# EAGLE design gemschematic (EAGLE 9.6.2)
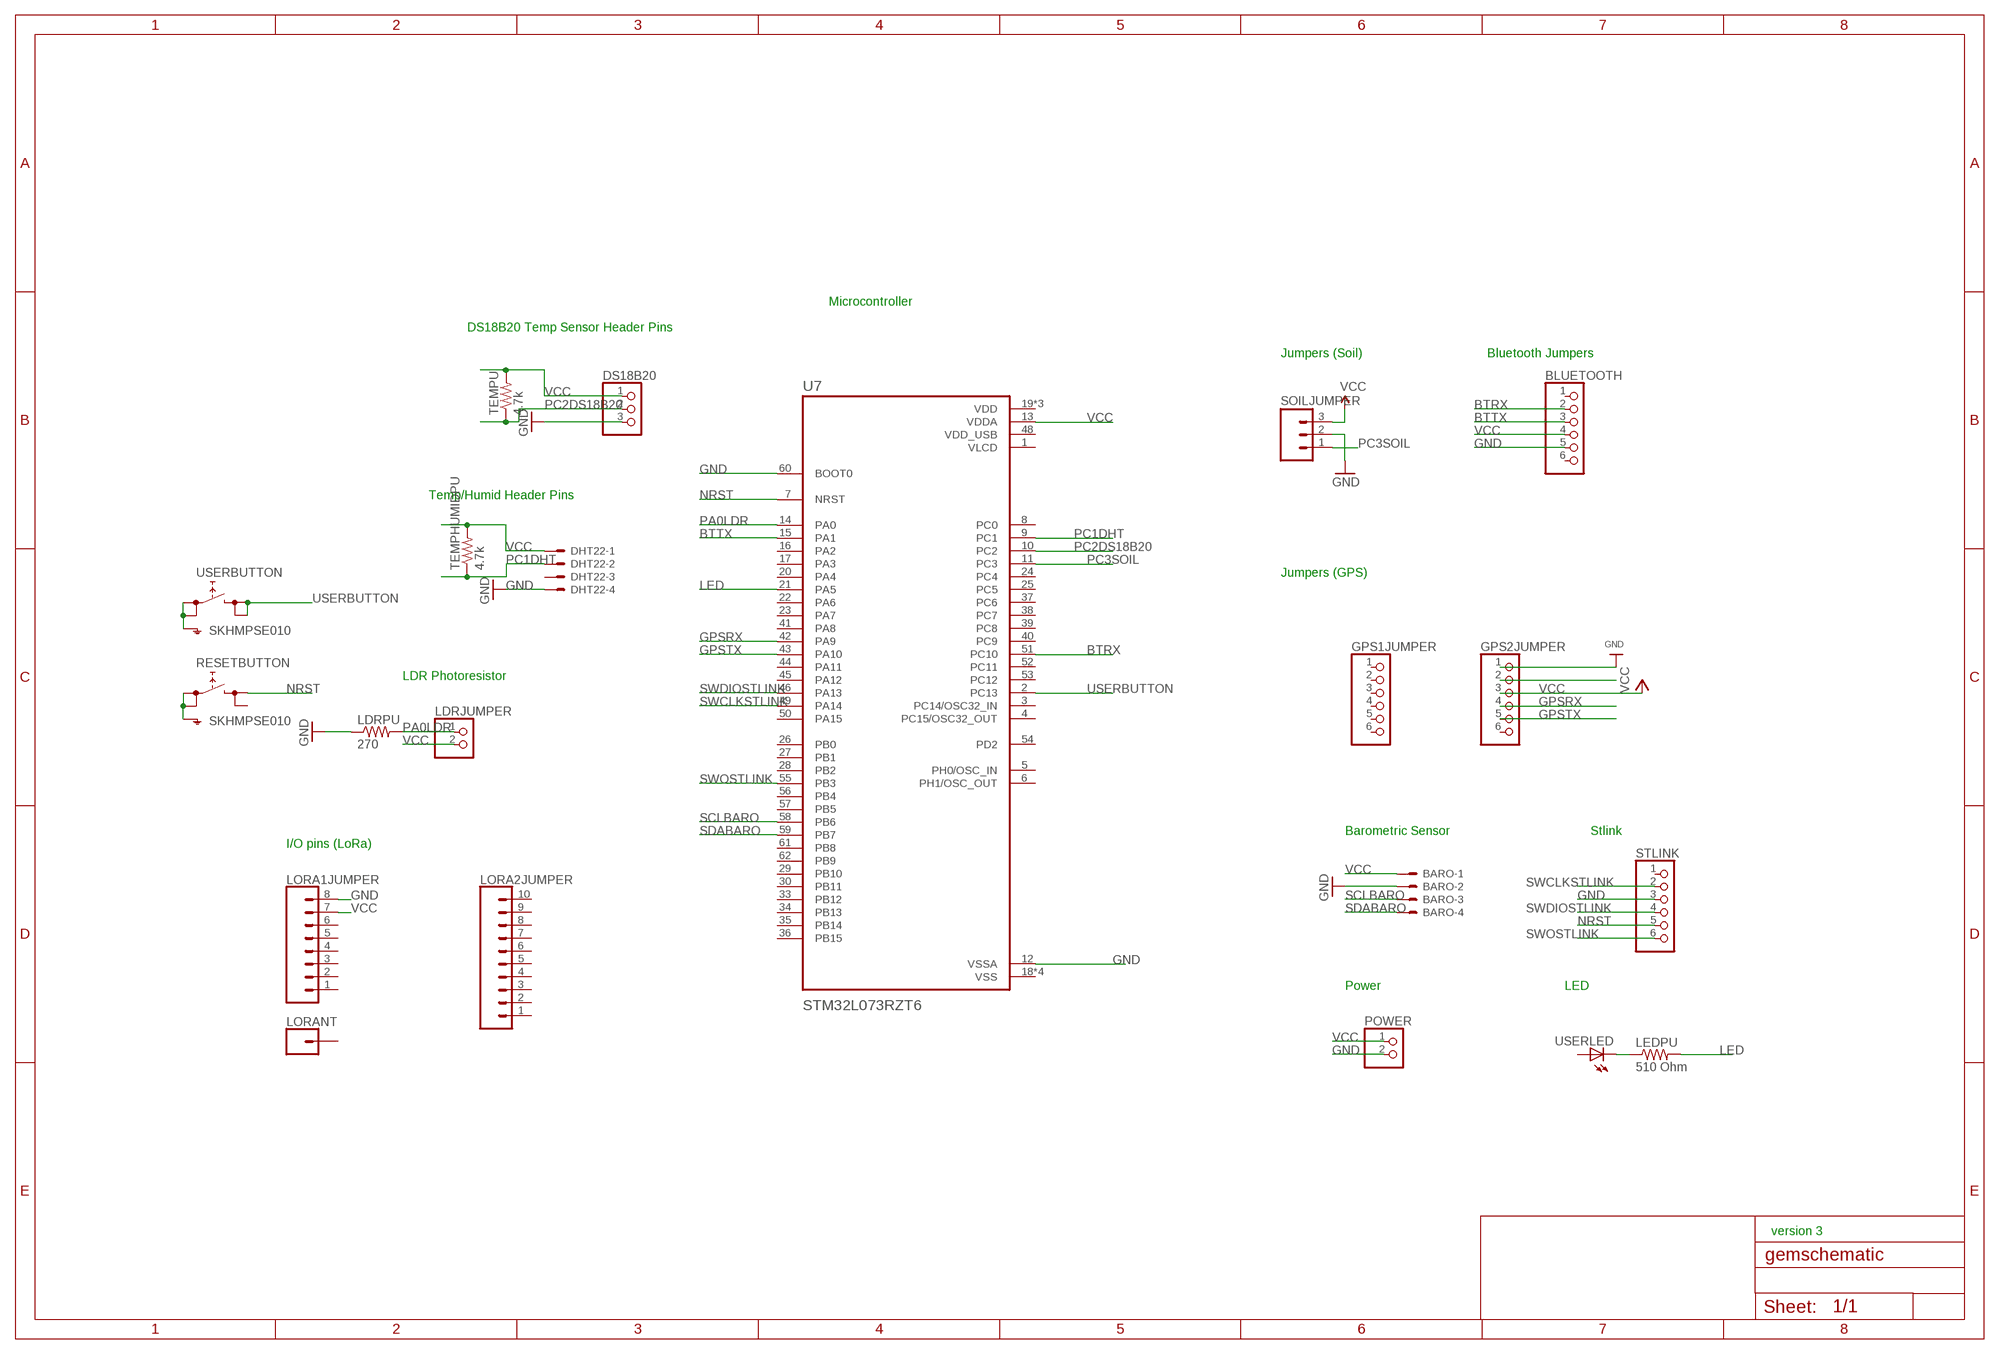
[diagram p0: schematic, sheet 1]

## Parts
BARO  22-23-2041  [22-23-2041]
BLUETOOTH  PINHD-1X6  [1X06]
DHT22  22-23-2041  [22-23-2041]
DS18B20  PINHD-1X3  [1X03]
GPS1JUMPER  HEADER-1X670MIL  [1X06_ROUND_70]
GPS2JUMPER  HEADER-1X670MIL  [1X06_ROUND_70]
LDRJUMPER  PINHD-1X2  [1X02]
LDRPU  270  R-US_M0805  [M0805]
LEDPU  510 Ohm  R-US_M0805  [M0805]
LORA1JUMPER  CONN_08NO_SILK_FEMALE_PTH  [1X08_NO_SILK]
LORA2JUMPER  CONN_10NO_SILK_PTH_FEMALE  [1X10_NO_SILK]
LORANT  CONN_01PTH_NO_SILK_YES_STOP  [1X01_NO_SILK]
POWER  PINHD-1X2  [1X02]
RESETBUTTON  SKHMPSE010  [SKHMPXE010]
SOILJUMPER  M03SCREW_LOCK  [SCREWTERMINAL-3.5MM-3_LOCK.007S]
STLINK  PINHD-1X6  [1X06]
TEMPHUMIDPU  4.7k  R-US_M0805  [M0805]
TEMPU  4.7k  R-US_M0805  [M0805]
U7  STM32L073RZT6  [QFP50P1200X1200X160-64N]
USERBUTTON  SKHMPSE010  [SKHMPXE010]
USERLED  LED3MM  [LED3MM]

## Nets
1PPS: GPS2JUMPER.2
BTRX: BLUETOOTH.2 U7.51(PC10)
BTTX: BLUETOOTH.3 U7.15(PA1)
GND: BARO.2 BLUETOOTH.5 DHT22.4 DS18B20.3 GPS2JUMPER.1 LDRPU.1 LORA1JUMPER.8 POWER.2 SOILJUMPER.2 STLINK.3 U7.12(VSSA) U7.60(BOOT0)
GPSRX: GPS2JUMPER.4 U7.42(PA9)
GPSTX: GPS2JUMPER.5 U7.43(PA10)
LED: LEDPU.2 U7.21(PA5)
N$1: LEDPU.1 USERLED.K(C)
N$2: USERBUTTON.1(1.1) USERBUTTON.2(1.2) USERBUTTON.5(SH)
N$4: RESETBUTTON.1(1.1) RESETBUTTON.2(1.2) RESETBUTTON.5(SH)
NRST: RESETBUTTON.3(2.1) STLINK.5 U7.7(NRST)
PA0LDR: LDRJUMPER.1 LDRPU.2 U7.14(PA0)
PC1DHT: DHT22.2 TEMPHUMIDPU.1 U7.9(PC1)
PC2DS18B20: DS18B20.2 TEMPU.1 U7.10(PC2)
PC3SOIL: SOILJUMPER.1 U7.11(PC3)
SCLBARO: BARO.3 U7.58(PB6)
SDABARO: BARO.4 U7.59(PB7)
SWCLKSTLINK: STLINK.2 U7.49(PA14)
SWDIOSTLINK: STLINK.4 U7.46(PA13)
SWOSTLINK: STLINK.6 U7.55(PB3)
USERBUTTON: U7.2(PC13) USERBUTTON.3(2.1) USERBUTTON.4(2.2)
VCC: BARO.1 BLUETOOTH.4 DHT22.1 DS18B20.1 GPS2JUMPER.3 LDRJUMPER.2 LORA1JUMPER.7 POWER.1 SOILJUMPER.3 TEMPHUMIDPU.2 TEMPU.2 U7.13(VDDA)
Unconnected: BLUETOOTH.1 BLUETOOTH.6 DHT22.3 GPS1JUMPER.1 GPS1JUMPER.2 GPS1JUMPER.3 GPS1JUMPER.4 GPS1JUMPER.5 GPS1JUMPER.6 GPS2JUMPER.6 LORA1JUMPER.1 LORA1JUMPER.2 LORA1JUMPER.3 LORA1JUMPER.4 LORA1JUMPER.5 LORA1JUMPER.6 LORA2JUMPER.1 LORA2JUMPER.2 LORA2JUMPER.3 LORA2JUMPER.4 LORA2JUMPER.5 LORA2JUMPER.6 LORA2JUMPER.7 LORA2JUMPER.8 LORA2JUMPER.9 LORA2JUMPER.10 LORANT.1 RESETBUTTON.4(2.2) STLINK.1 U7.3(PC14/OSC32_IN) U7.4(PC15/OSC32_OUT) U7.5(PH0/OSC_IN) U7.6(PH1/OSC_OUT) U7.8(PC0) U7.16(PA2) U7.17(PA3) U7.20(PA4) U7.22(PA6) U7.23(PA7) U7.24(PC4) U7.25(PC5) U7.26(PB0) U7.27(PB1) U7.28(PB2) U7.29(PB10) U7.30(PB11) U7.33(PB12) U7.34(PB13) U7.35(PB14) U7.36(PB15) U7.37(PC6) U7.38(PC7) U7.39(PC8) U7.40(PC9) U7.41(PA8) U7.44(PA11) U7.45(PA12) U7.50(PA15) U7.52(PC11) U7.53(PC12) U7.54(PD2) U7.56(PB4) U7.57(PB5) U7.61(PB8) U7.62(PB9) USERLED.A

## Notes on the sheet
- Microcontroller
- DS18B20 Temp Sensor Header Pins
- Jumpers (Soil) | Bluetooth Jumpers
- Temp/Humid Header Pins
- Jumpers (GPS)
- LDR Photoresistor
- Barometric Sensor | Stlink
- I/O pins (LoRa)
- Power | LED
- version 3

## Power pins joined to a net without a drawn wire
VDD: U7.19(VDD) U7.32(VDD) U7.64(VDD)
VDD_USB: U7.48(VDD_USB)
VLCD: U7.1(VLCD)
VSS: U7.18(VSS) U7.31(VSS) U7.47(VSS) U7.63(VSS)

## Library data of the parts
BARO DHT22 = con-molex:22-23-2041: .100" (2.54mm) Center Header - 4 Pin; MF: MOLEX; MPN: 22-23-2041; OC_FARNELL: 1462920; OC_NEWARK: 38C0355
BLUETOOTH STLINK = adafruit:PINHD-1X6: PIN HEADER
DS18B20 = adafruit:PINHD-1X3: PIN HEADER
GPS1JUMPER GPS2JUMPER = microbuilder:HEADER-1X6: PIN HEADER
LDRJUMPER POWER = pinhead:PINHD-1X2: PIN HEADER
LDRPU LEDPU TEMPHUMIDPU TEMPU = adafruit:R-US_: RESISTOR, American symbol
LORA1JUMPER = SparkFun-Connectors:CONN_08: Multi connection point. Often used as Generic Header-pin footprint for 0.1 inch spaced/style header connections On any of the 0.1 inch spaced packages, you can populate with these: Break Away Headers - Straight <https://www.sparkfun.com/products/116> (PRT-00116) Break Away Male Headers - Right Angle <https://www.sparkfun.com/products/553> (PRT-00553) Female Headers <https://www.sparkfun.com/products/115> (PRT-00115) Break Away Headers - Machine Pin <https://www.sparkfun.com/products/117> (PRT-00117) Break Away Female Headers - Swiss Machine Pin <https://www.sparkfun.com/products/743> (PRT-00743) Arduino Stackable Header - 8 Pin <https://www.sparkfun.com/products/9279> (PRT-09279) For SCREWTERMINALS and SPRING TERMINALS visit here: Screw Terimnals on SparkFun.com <https://www.sparkfun.com/search/results?term=Screw+Terminals> (5mm/3.5mm/2.54mm spacing) This device is also useful as a general connection point to wire up your design to another part of your project. Our various solder wires solder well into these plated through hole pads. Hook-Up Wire - Assortment (Stranded, 22 AWG) <https://www.sparkfun.com/products/11375> (PRT-11375) Hook-Up Wire - Assortment (Solid Core, 22 AWG) <https://www.sparkfun.com/products/11367> (PRT-11367) View the entire wire category on our website here <https://www.sparkfun.com/categories/141> Special notes: Molex polarized connector foot print use with SKU : PRT-08231 with associated crimp pins and housings. 1MM SMD Version SKU: PRT-10208 NOTES ON THE VARIANTS LOCK and LOCK_LONGPADS... This footprint was designed to help hold the alignment of a through-hole component (i.e. 6-pin header) while soldering it into place. You may notice that each hole has been shifted either up or down by 0.005 of an inch from it's more standard position (which is a perfectly straight line). This slight alteration caused the pins (the squares in the middle) to touch the edges of the holes. Because they are alternating, it causes a "brace" to hold the component in place. 0.005 has proven to be the perfect amount of "off-center" position when using our standard breakaway headers. Although looks a little odd when you look at the bare footprint, once you have a header in there, the alteration is very hard to notice. Also,if you push a header all the way into place, it is covered up entirely on the bottom side.; PROD_ID: CONN-08438
LORA2JUMPER = SparkFun-Connectors:CONN_10: Multi connection point. Often used as Generic Header-pin footprint for 0.1 inch spaced/style header connections On any of the 0.1 inch spaced packages, you can populate with these: Break Away Headers - Straight <https://www.sparkfun.com/products/116> (PRT-00116) Break Away Male Headers - Right Angle <https://www.sparkfun.com/products/553> (PRT-00553) Female Headers <https://www.sparkfun.com/products/115> (PRT-00115) Break Away Headers - Machine Pin <https://www.sparkfun.com/products/117> (PRT-00117) Break Away Female Headers - Swiss Machine Pin <https://www.sparkfun.com/products/743> (PRT-00743) Arduino Stackable Header - 10 Pin <https://www.sparkfun.com/products/11376> (PRT-11376) For SCREWTERMINALS and SPRING TERMINALS visit here: Screw Terimnals on SparkFun.com <https://www.sparkfun.com/search/results?term=Screw+Terminals> (5mm/3.5mm/2.54mm spacing) This device is also useful as a general connection point to wire up your design to another part of your project. Our various solder wires solder well into these plated through hole pads. Hook-Up Wire - Assortment (Stranded, 22 AWG) <https://www.sparkfun.com/products/11375> (PRT-11375) Hook-Up Wire - Assortment (Solid Core, 22 AWG) <https://www.sparkfun.com/products/11367> (PRT-11367) View the entire wire category on our website here <https://www.sparkfun.com/categories/141> Special notes: Molex polarized connector foot print use with SKU : PRT-08231 with associated crimp pins and housings. 1MM SMD Version SKU: PRT-10208 NOTES ON THE VARIANTS LOCK and LOCK_LONGPADS... This footprint was designed to help hold the alignment of a through-hole component (i.e. 6-pin header) while soldering it into place. You may notice that each hole has been shifted either up or down by 0.005 of an inch from it's more standard position (which is a perfectly straight line). This slight alteration caused the pins (the squares in the middle) to touch the edges of the holes. Because they are alternating, it causes a "brace" to hold the component in place. 0.005 has proven to be the perfect amount of "off-center" position when using our standard breakaway headers. Although looks a little odd when you look at the bare footprint, once you have a header in there, the alteration is very hard to notice. Also,if you push a header all the way into place, it is covered up entirely on the bottom side.; PROD_ID: CONN-11563
LORANT = SparkFun-Connectors:CONN_01: Single connection point. Often used as Generic Header-pin footprint for 0.1 inch spaced/style header connections On any of the 0.1 inch spaced packages, you can populate with these: Break Away Headers - Straight <https://www.sparkfun.com/products/116> (PRT-00116) Break Away Male Headers - Right Angle <https://www.sparkfun.com/products/553> (PRT-00553) Female Headers <https://www.sparkfun.com/products/115> (PRT-00115) Break Away Headers - Machine Pin <https://www.sparkfun.com/products/117> (PRT-00117) Break Away Female Headers - Swiss Machine Pin <https://www.sparkfun.com/products/743> (PRT-00743) This device is also useful as a general connection point to wire up your design to another part of your project. Our various solder wires solder well into these plated through hole pads. Hook-Up Wire - Assortment (Stranded, 22 AWG) <https://www.sparkfun.com/products/11375> (PRT-11375) Hook-Up Wire - Assortment (Solid Core, 22 AWG) <https://www.sparkfun.com/products/11367> (PRT-11367) View the entire wire category on our website here <https://www.sparkfun.com/categories/141> Special notes: SMTSO-256-ET is a "flush mount" nut for a 4-40 screw. We mostly use this on specialty testbeds; it is a nice way to connect hardware to your PCB at an adjustable hieght. Also note, the SNAP packages are for using a snappable style connector. We sell a baggie of snaps and they are also used on two LilyPad designs: Snap Assortment - 30 pack (male and female) <https://www.sparkfun.com/products/11347> (DEV-11347) LilyPad Arduino SimpleSnap <https://www.sparkfun.com/products/10941> (DEV-10941) LilyPad SimpleSnap Protoboard <https://www.sparkfun.com/products/10940> (DEV-10940)
RESETBUTTON USERBUTTON = switch:SKHMP*E010: 6.2 X 6.5mm TACT Switch (SMD) Source: http://www3.alps.co.jp/WebObjects/catalog.woa/PDF/E/Switch/Tact/SKHM/SKHM.PDF
SOILJUMPER = SparkFun-Connectors:M03: Header 3 Standard 3-pin 0.1" header. Use with straight break away headers (SKU : PRT-00116), right angle break away headers (PRT-00553), swiss pins (PRT-00743), machine pins (PRT-00117), and female headers (PRT-00115). Molex polarized connector foot print use with SKU : PRT-08232 with associated crimp pins and housings.; PROD_ID: CONN-08288
U7 = STM32L073RZT6:STM32L073RZT6: None Check availability <https://pricing.snapeda.com/parts/STM32L073RZT6/STMicroelectronics/view-part?ref=eda>; AVAILABILITY: In Stock; DESCRIPTION: ARM® Cortex®-M0+ STM32L0 Microcontroller IC 32-Bit 32MHz 192KB (192K x 8) FLASH 64-LQFP (10x10); MF: STMicroelectronics; MP: STM32L073RZT6; PACKAGE: LQFP-64 STMicroelectronics; PRICE: None; PURCHASE-URL: https://pricing.snapeda.com/search/part/STM32L073RZT6/?ref=eda
USERLED = adafruit:LED: LED OSRAM: - CHIPLED LG R971, LG N971, LY N971, LG Q971, LY Q971, LO R971, LY R971 LH N974, LH R974 LS Q976, LO Q976, LY Q976 LO Q996 - Hyper CHIPLED LW Q18S LB Q993, LB Q99A, LB R99A - SideLED LS A670, LO A670, LY A670, LG A670, LP A670 LB A673, LV A673, LT A673, LW A673 LH A674 LY A675 LS A676, LA A676, LO A676, LY A676, LW A676 LS A679, LY A679, LG A679 - Hyper Micro SIDELED® LS Y876, LA Y876, LO Y876, LY Y876 LT Y87S - SmartLED LW L88C, LW L88S LB L89C, LB L89S, LG L890 LS L89K, LO L89K, LY L89K LS L896, LA L896, LO L896, LY L896 - TOPLED LS T670, LO T670, LY T670, LG T670, LP T670 LSG T670, LSP T670, LSY T670, LOP T670, LYG T670 LG T671, LOG T671, LSG T671 LB T673, LV T673, LT T673, LW T673 LH T674 LS T676, LA T676, LO T676, LY T676, LB T676, LH T676, LSB T676, LW T676 LB T67C, LV T67C, LT T67C, LS T67K, LO T67K, LY T67K, LW E67C LS E67B, LA E67B, LO E67B, LY E67B, LB E67C, LV E67C, LT E67C LW T67C LS T679, LY T679, LG T679 LS T770, LO T770, LY T770, LG T770, LP T770 LB T773, LV T773, LT T773, LW T773 LH T774 LS E675, LA E675, LY E675, LS T675 LS T776, LA T776, LO T776, LY T776, LB T776 LHGB T686 LT T68C, LB T68C - Hyper Mini TOPLED® LB M676 - Mini TOPLED Santana® LG M470 LS M47K, LO M47K, LY M47K Source: http://www.osram.convergy.de/

## Net classes
0 default: width 0.152 mm, drill 0.305 mm
1 highpower: width 0.406 mm, drill 0.483 mm
2 lowpower: width 0.305 mm, drill 0.483 mm

## Board
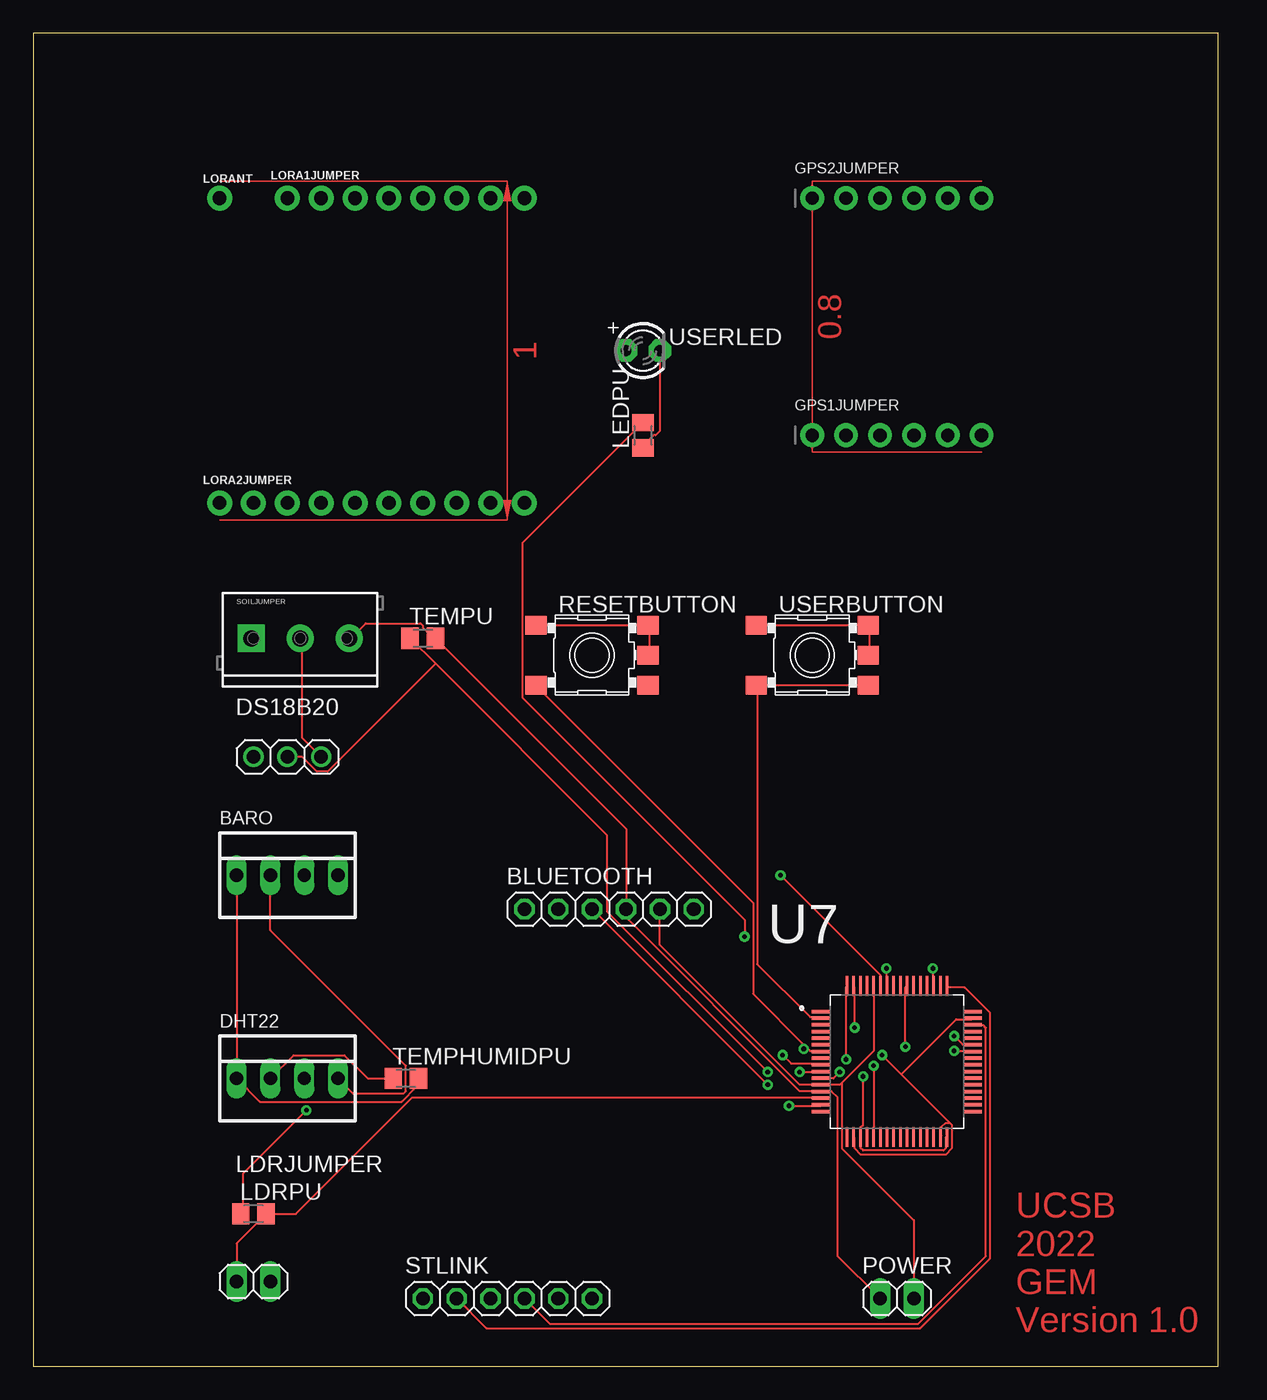
[diagram p1: board, top side]
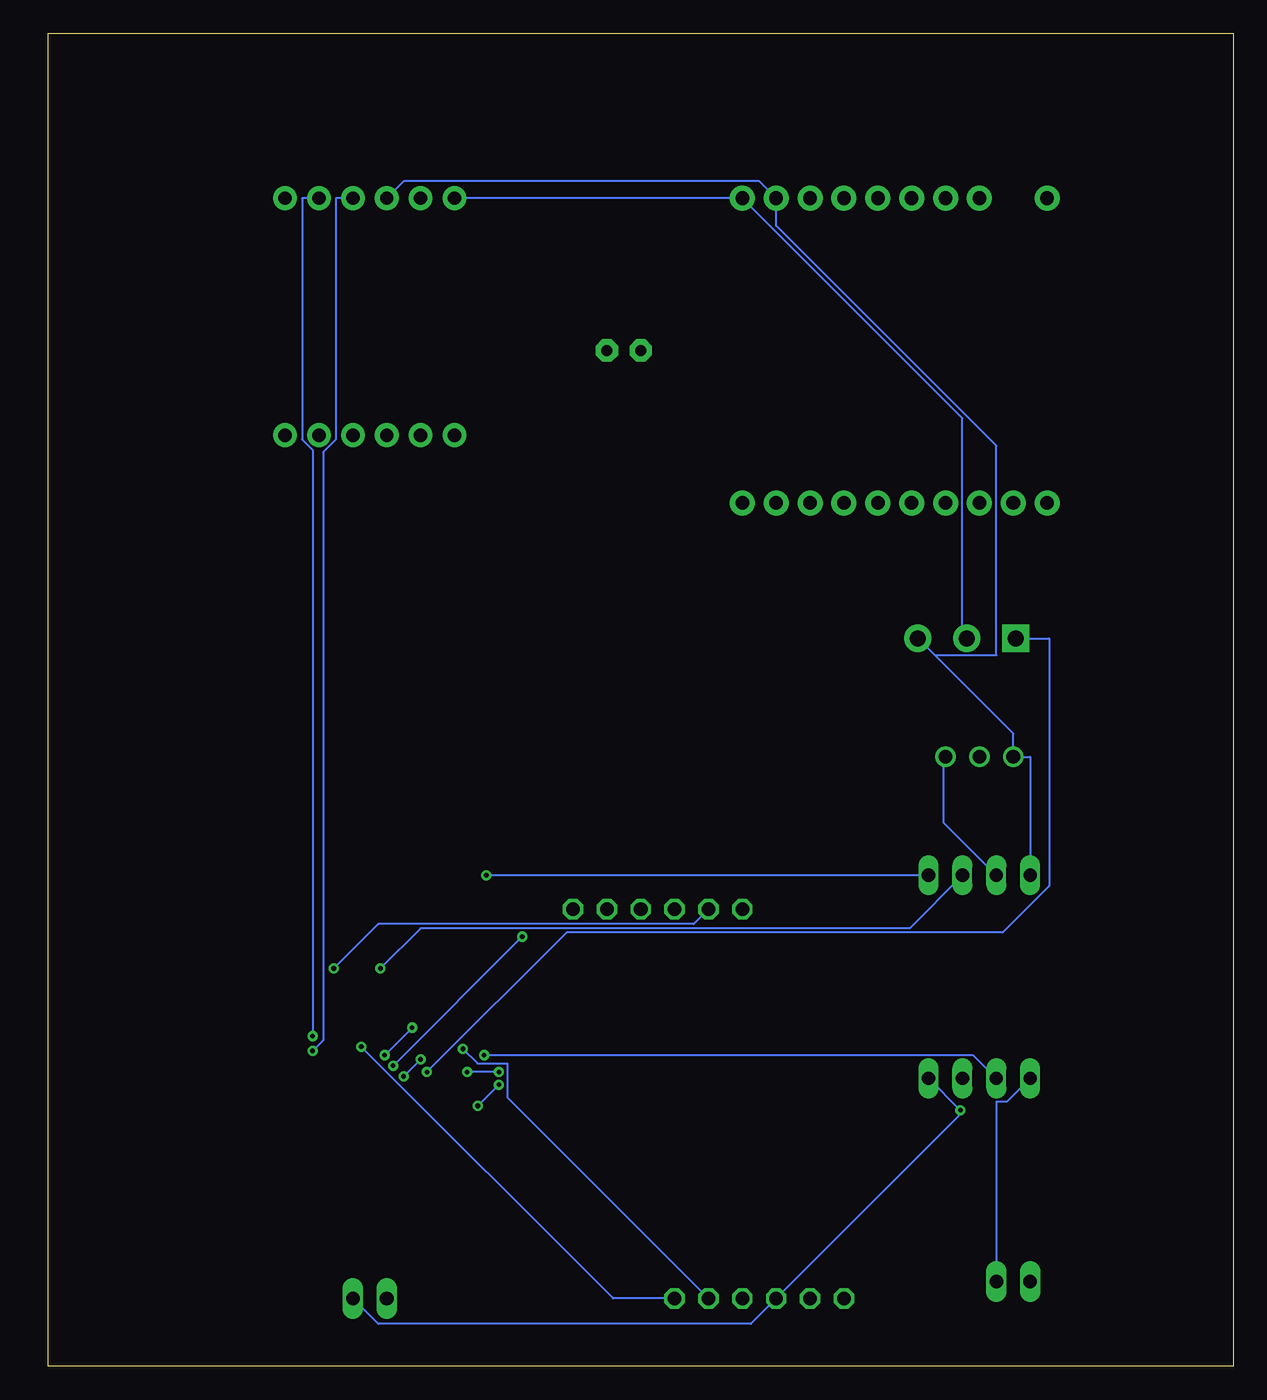
[diagram p2: board, bottom side, seen from below]

Size 88.88 x 100 mm. Coordinates in mm from the lower left corner, seen from the top.
Outline: 0,0 88.88,0 88.88,100 0,100 0,0
Copper layers (1*16): Top 0.035mm / dielectric 1.5mm / Bottom 0.035mm
Design rules "default": minimum track width 6mil, minimum drill 0.35mm, track to track 6mil, track to pad 6mil, pad to pad 6mil, via to via 6mil, smd to smd 6mil, copper to edge 40mil, drill to drill 6mil, minimum pad ring 10mil, minimum via ring 8mil, stop-mask expansion 4mil, vias tented up to drill 0mil, thermal gap 10mil

### Footprints (pad centres in the part's own frame; a part is rotated, then mirrored left to right if it is on the bottom)
22-23-2041 = drill 1 long: 1 -3.81,0; 2 -1.27,0; 3 1.27,0; 4 3.81,0
1X06 = drill 1.016 octagon: 1 -6.35,0; 2 -3.81,0; 3 -1.27,0; 4 1.27,0; 5 3.81,0; 6 6.35,0
1X03 = drill 1.016: 1 -2.54,0; 2 0,0; 3 2.54,0
1X06_ROUND_70 = drill 1 pad 1.778: 1 -6.35,0; 2 -3.81,0; 3 -1.27,0; 4 1.27,0; 5 3.81,0; 6 6.35,0
1X02 = drill 1.016 long: 1 -1.27,0; 2 1.27,0
M0805 = smd 1.3 x 1.6: 1 -0.95,0; 2 0.95,0
1X08_NO_SILK = drill 1.016 pad 1.88: 1 0,0; 2 2.54,0; 3 5.08,0; 4 7.62,0; 5 10.16,0; 6 12.7,0; 7 15.24,0; 8 17.78,0
1X10_NO_SILK = drill 1.016 pad 1.88: 1 0,0; 2 2.54,0; 3 5.08,0; 4 7.62,0; 5 10.16,0; 6 12.7,0; 7 15.24,0; 8 17.78,0; 9 20.32,0; 10 22.86,0
1X01_NO_SILK = drill 1.016 pad 1.88: 1 0,0
SKHMPXE010 = smd 1.6 x 1.4: 1 -4.2,2.25; 2 4.2,2.25; 3 -4.2,-2.25; 4 4.2,-2.25; 5 4.2,0
SCREWTERMINAL-3.5MM-3_LOCK.007S = drill 1.2 pad 2.032 square: 1 -0.178,0 | drill 1.2 pad 2.032: 2 3.5,0; 3 7.178,0
QFP50P1200X1200X160-64N = smd 1.47 x 0.25: 1 -5.67,3.75; 2 -5.67,3.25; 3 -5.67,2.75; 4 -5.67,2.25; 5 -5.67,1.75; 6 -5.67,1.25; 7 -5.67,0.75; 8 -5.67,0.25; 9 -5.67,-0.25; 10 -5.67,-0.75; 11 -5.67,-1.25; 12 -5.67,-1.75; 13 -5.67,-2.25; 14 -5.67,-2.75; 15 -5.67,-3.25; 16 -5.67,-3.75; 33 5.67,-3.75; 34 5.67,-3.25; 35 5.67,-2.75; 36 5.67,-2.25; 37 5.67,-1.75; 38 5.67,-1.25; 39 5.67,-0.75; 40 5.67,-0.25; 41 5.67,0.25; 42 5.67,0.75; 43 5.67,1.25; 44 5.67,1.75; 45 5.67,2.25; 46 5.67,2.75; 47 5.67,3.25; 48 5.67,3.75 | smd 0.25 x 1.47: 17 -3.75,-5.67; 18 -3.25,-5.67; 19 -2.75,-5.67; 20 -2.25,-5.67; 21 -1.75,-5.67; 22 -1.25,-5.67; 23 -0.75,-5.67; 24 -0.25,-5.67; 25 0.25,-5.67; 26 0.75,-5.67; 27 1.25,-5.67; 28 1.75,-5.67; 29 2.25,-5.67; 30 2.75,-5.67; 31 3.25,-5.67; 32 3.75,-5.67; 49 3.75,5.67; 50 3.25,5.67; 51 2.75,5.67; 52 2.25,5.67; 53 1.75,5.67; 54 1.25,5.67; 55 0.75,5.67; 56 0.25,5.67; 57 -0.25,5.67; 58 -0.75,5.67; 59 -1.25,5.67; 60 -1.75,5.67; 61 -2.25,5.67; 62 -2.75,5.67; 63 -3.25,5.67; 64 -3.75,5.67
LED3MM = drill 0.813 pad 1.676 octagon: A -1.27,0; K 1.27,0

### Placement (x,y rotation side)
BARO  19.05,36.83 0 top
BLUETOOTH  43.18,34.29 0 top
DHT22  19.05,21.59 0 top
DS18B20  19.05,45.72 0 top
GPS1JUMPER  64.77,69.85 0 top
GPS2JUMPER  64.77,87.63 0 top
LDRJUMPER  16.51,6.35 0 top
LDRPU  16.51,11.43 0 top
LEDPU  45.72,69.85 90 top
LORA1JUMPER  19.05,87.63 0 top
LORA2JUMPER  13.97,64.77 0 top
LORANT  13.97,87.63 0 top
POWER  64.77,5.08 0 top
RESETBUTTON  41.91,53.34 0 top
SOILJUMPER  16.51,54.61 0 top
STLINK  35.56,5.08 0 top
TEMPHUMIDPU  27.94,21.59 0 top
TEMPU  29.21,54.61 0 top
U7  64.77,22.86 0 top
USERBUTTON  58.42,53.34 0 top
USERLED  45.72,76.2 0 top

### Tracks (layer width: path | path; a pad name or v marks a point on that pad's centre or on a via)
BTRX  (via drill 0.35)
  Top 0.152: v67.47,29.84 67.47,28.57 U7.51
  Bottom 0.152: v67.47,29.84 64.14,33.18 40.48,33.18 BLUETOOTH.2
BTTX  (via drill 0.35)
  Top 0.152: v56.67,19.53 59.05,19.53 U7.15 | BLUETOOTH.3 v55.09,21.11
  Bottom 0.152: v55.09,21.11 v56.67,19.53
GND  (via drill 0.35)
  Top 0.152: 60.64,21.27 63.02,23.65 63.02,28.42 U7.60 | 60.64,21.27 60.48,21.11 59.21,21.11 U7.12 59.05,21.11 57.47,21.11 46.99,31.59 BLUETOOTH.5 | POWER.2 66.04,10.95 60.64,16.35 60.64,21.27 | DS18B20.3 20.16,47.15 20.16,54.61 SOILJUMPER.2 | v20.48,19.21 15.72,14.45 15.72,11.43 LDRPU.1 | BARO.2 17.78,32.7 27.94,22.54 27.94,20.64 27.78,20.48 23.97,20.48 DHT22.4
  Bottom 0.152: GPS2JUMPER.1 LORA1JUMPER.8 20.32,71.12 20.32,54.61 SOILJUMPER.2 | BARO.2 21.75,40.8 21.75,45.72 DS18B20.3 | DHT22.4 v20.48,19.21 20.48,18.89 STLINK.3 36.2,3.17 64.14,3.17 POWER.2
GPSRX  (via drill 0.35)
  Top 0.152: v69.06,23.65 70.33,23.65 U7.42
  Bottom 0.152: v69.06,23.65 68.26,24.45 68.26,68.58 67.31,69.53 67.31,87.63 GPS2JUMPER.4
GPSTX  (via drill 0.35)
  Top 0.152: v69.06,24.77 69.69,24.13 70.33,24.13 U7.43
  Bottom 0.152: v69.06,24.77 69.06,68.74 69.85,69.53 69.85,87.63 GPS2JUMPER.5
LED  (via drill 0.35)
  Top 0.152: v63.02,22.54 63.02,17.3 U7.21 | v53.34,32.23 53.34,33.5 36.67,50.16 36.67,61.75 LEDPU.2
  Bottom 0.152: v53.34,32.23 v63.02,22.54
N$1
  Top 0.152: USERLED.K 46.99,70.17 46.67,69.85 46.51,69.85 45.72,69.06 LEDPU.1
N$2
  Top 0.152: USERBUTTON.1 54.29,55.56 62.55,55.56 USERBUTTON.2 62.71,55.56 62.71,53.34 USERBUTTON.5
N$4
  Top 0.152: RESETBUTTON.1 37.78,55.56 46.04,55.56 RESETBUTTON.2 46.2,55.56 46.2,53.34 RESETBUTTON.5
NRST  (via drill 0.35)
  Top 0.152: 57.94,23.97 53.98,27.94 53.98,34.77 37.78,50.96 RESETBUTTON.3 | 57.94,23.97 58.26,23.65 59.05,23.65 U7.7 | 57.94,23.97 v57.78,23.81
  Bottom 0.152: STLINK.5 54.45,20.16 54.45,22.7 56.67,22.7 v57.78,23.81
PA0LDR
  Top 0.152: LDRPU.2 19.68,11.43 28.42,20.16 59.05,20.16 U7.14 | LDRJUMPER.1 15.24,9.21 LDRPU.2 | LDRPU.2
PC1DHT  (via drill 0.35)
  Top 0.152: v56.2,23.34 56.83,22.7 59.05,22.7 U7.9 | TEMPHUMIDPU.1 25.08,21.59 23.34,23.34 19.53,23.34 DHT22.2
  Bottom 0.152: v56.2,23.34 19.53,23.34 DHT22.2
PC2DS18B20  (via drill 0.35)
  Top 0.152: v57.47,22.07 59.05,22.07 U7.10 | v55.09,22.07 43.02,34.13 43.02,39.85 30.16,52.7 | 30.16,52.7 TEMPU.1 | DS18B20.2 20.16,45.72 21.27,44.61 22.07,44.61 30.16,52.7
  Bottom 0.152: v55.09,22.07 v57.47,22.07
PC3SOIL  (via drill 0.35)
  Top 0.152: v60.48,22.07 60.01,21.59 59.21,21.59 U7.11
  Bottom 0.152: v60.48,22.07 50.01,32.54 17.3,32.54 13.81,36.04 13.81,54.61 SOILJUMPER.1
SCLBARO  (via drill 0.35)
  Top 0.152: v63.98,29.84 63.98,28.57 U7.58
  Bottom 0.152: v63.98,29.84 60.96,32.86 24.29,32.86 BARO.3
SDABARO  (via drill 0.35)
  Top 0.152: v56.04,36.83 63.5,29.37 63.5,28.57 U7.59
  Bottom 0.152: BARO.4 v56.04,36.83
SWCLKSTLINK
  Top 0.152: STLINK.2 33.97,2.86 66.52,2.86 71.75,8.1 71.75,26.51 69.85,28.42 68.58,28.42 U7.49
SWDIOSTLINK
  Top 0.152: STLINK.4 38.73,3.17 66.36,3.17 71.44,8.26 71.44,25.4 71.28,25.56 70.48,25.56 U7.46
SWOSTLINK  (via drill 0.35)
  Top 0.152: v65.41,23.97 65.41,28.42 U7.55
  Bottom 0.152: v65.41,23.97 46.51,5.08 STLINK.6
USERBUTTON
  Top 0.152: U7.2 59.05,26.19 58.26,26.19 54.29,30.16 54.29,50.96 USERBUTTON.3 54.29,51.12 62.55,51.12 USERBUTTON.4
VCC
  Top 0.152: POWER.1 60.33,8.26 60.33,20.16 59.85,20.64 59.21,20.64 U7.13 59.05,20.64 57.47,20.64 44.45,33.66 BLUETOOTH.4 44.45,40.32 TEMPU.2 30,54.61 29.21,55.4 29.21,55.56 29.05,55.72 24.92,55.72 23.81,54.61 SOILJUMPER.3 | TEMPHUMIDPU.2 28.73,21.59 28.73,20.95 27.62,19.84 16.99,19.84 DHT22.1 BARO.1
  Bottom 0.152: GPS2JUMPER.3 62.23,88.9 35.56,88.9 LORA1JUMPER.7 34.29,85.57 17.78,69.06 17.78,53.34 22.38,53.34 | LDRJUMPER.2 17.78,19.84 16.99,19.84 DHT22.1 | BARO.1 15.24,45.72 DS18B20.1 16.51,47.47 22.38,53.34 | 22.38,53.34 23.65,54.61 SOILJUMPER.3
VDD  (via drill 0.35)
  Top 0.152: U7.32 68.42,17.14 68.42,16.35 68.26,16.19 62.23,16.19 62.07,16.35 62.07,17.14 U7.19 62.07,17.3 62.07,17.94 62.23,18.1 v62.23,21.75 | v60.96,23.02 60.96,28.42 U7.64
  Bottom 0.152: v62.23,21.75 v60.96,23.02
VSS  (via drill 0.35)
  Top 0.152: 68.74,18.26 68.9,18.1 68.9,16.35 68.42,15.88 62.07,15.88 61.59,16.35 61.59,17.14 U7.18 | 68.74,18.26 68.42,18.26 68.1,17.94 68.1,17.3 U7.31 | v61.59,25.4 61.59,28.42 U7.63 | 68.74,18.26 65.09,21.91 | 65.09,21.91 v63.66,23.34 | 65.09,21.91 69.22,26.04 70.33,26.04 U7.47
  Bottom 0.152: v63.66,23.34 v61.59,25.4
(copper drawn outside any net)
  shapes: Top area x2

### Text on the board
Top: UCSB / 2022 / GEM / Version 1.0